# EAGLE design ACS758CurrentSensor (EAGLE 7.4.0)
CNAME: Current Sensor; CREVISION: 1.0; DESIGNER: Ye Wang
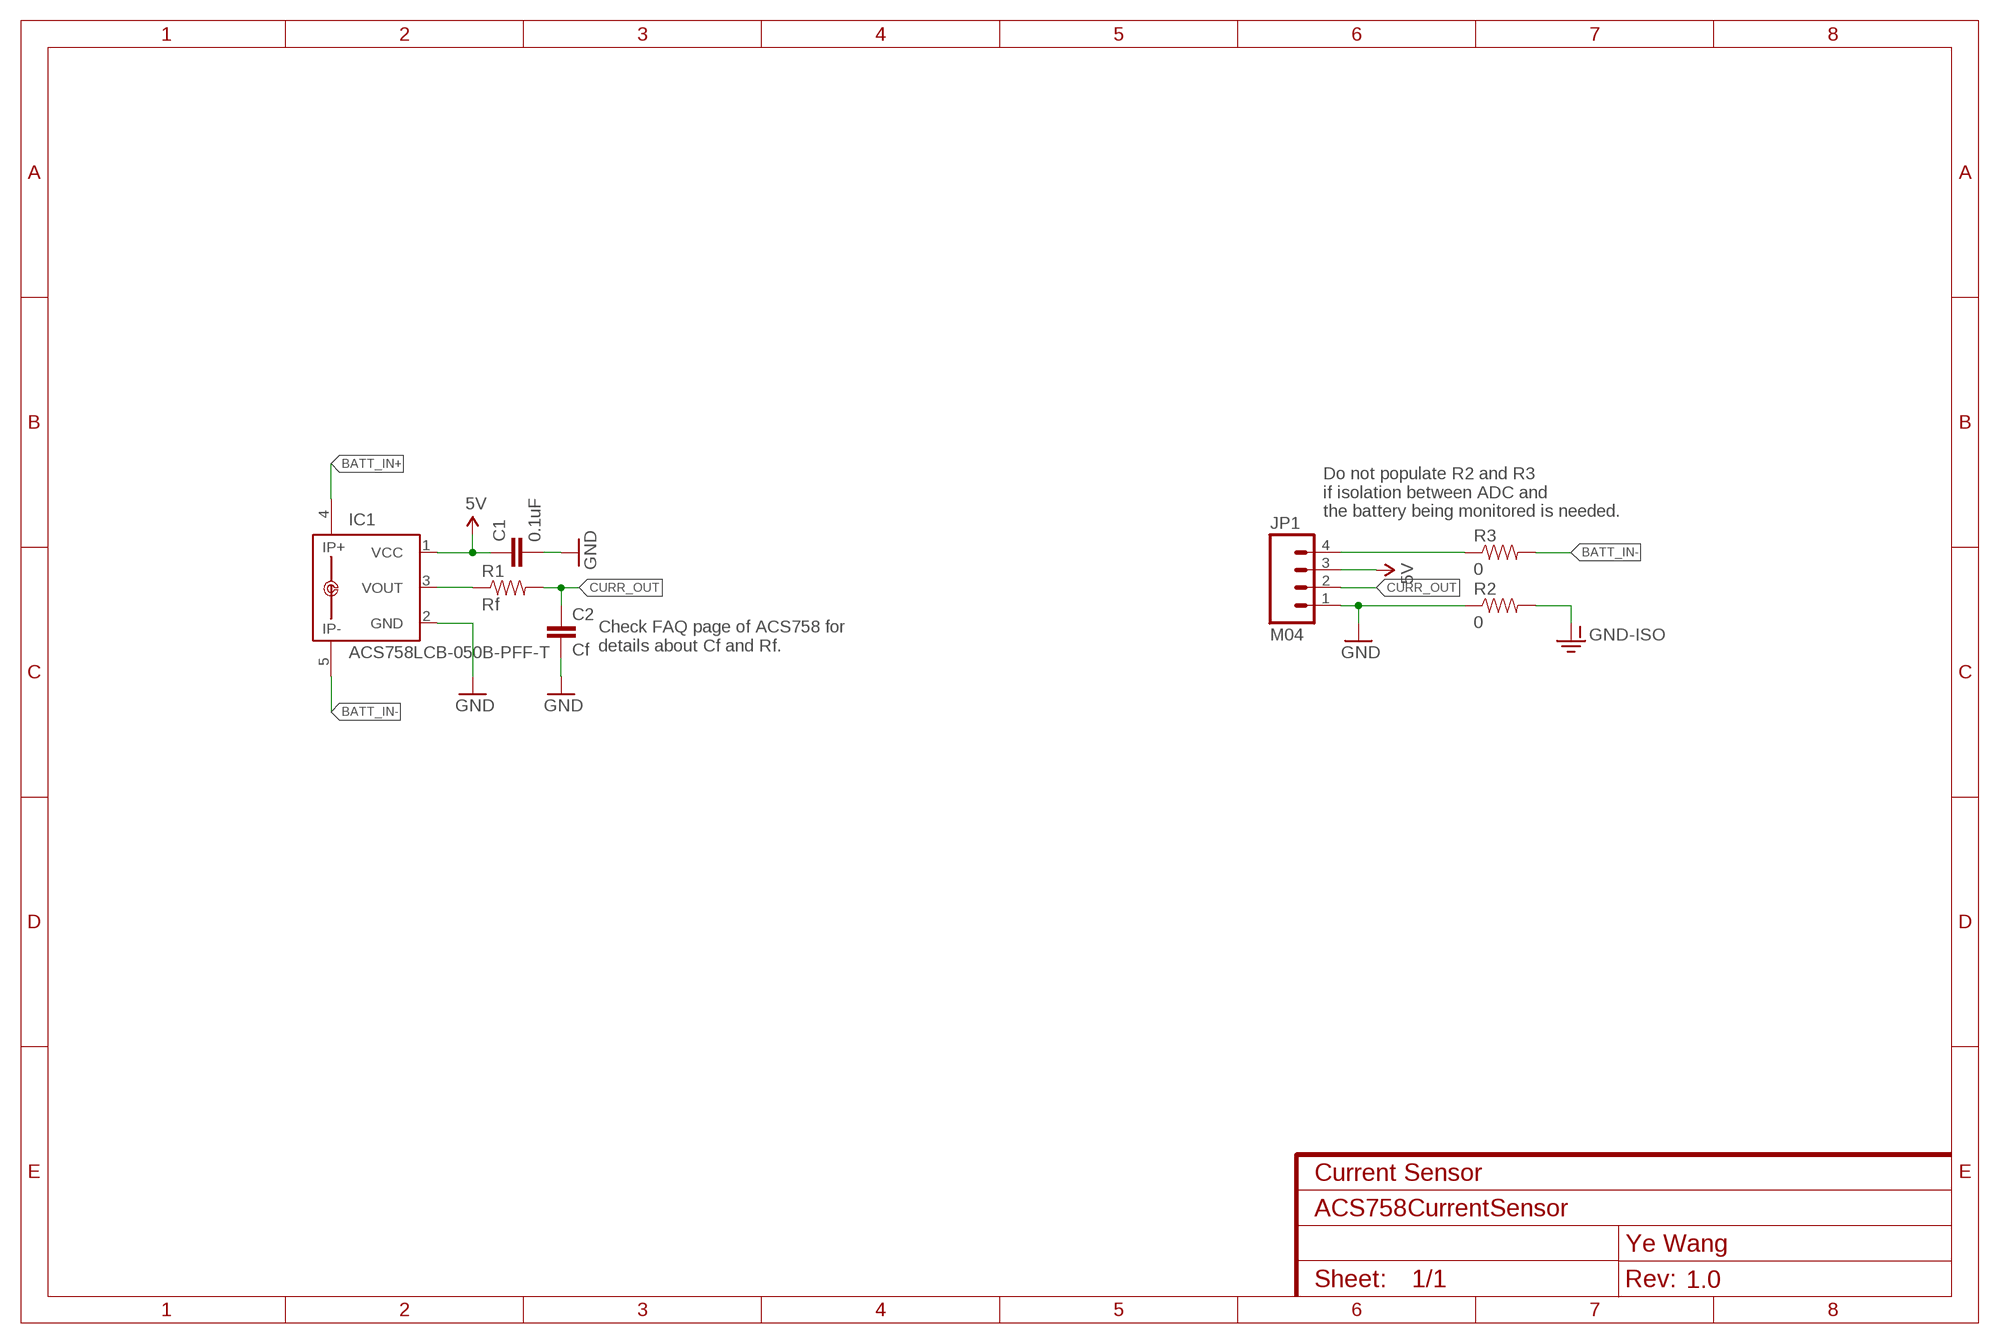
[diagram p0: schematic, sheet 1]

## Parts
C1  0.1uF  CAP0603-CAP  [0603-CAP]
C2  Cf  CAP0603-CAP  [0603-CAP]
IC1  ACS758LCB-050B-PFF-T  [CB-PFF]
JP1  M04  M04PTH  [1X04]
R1  Rf  0OHM-1/10W-5%(0603)  [0603]
R2  0  0OHM-1/10W-5%(0603)  [0603]
R3  0  0OHM-1/10W-5%(0603)  [0603]

## Nets
5V: C1.1 IC1.1(VCC) JP1.3
BATT_IN+: IC1.4(IP+)
BATT_IN-: IC1.5(IP-) R3.2
CURR_OUT: C2.1 JP1.2 R1.2
GND: C1.2 C2.2 IC1.2(GND) JP1.1 R2.1
GND-ISO: R2.2
N$1: IC1.3(VOUT) R1.1
N$2: JP1.4 R3.1
Unconnected: IC1.IP+1 IC1.IP-1

## Notes on the sheet
- Do not populate R2 and R3
  if isolation between ADC and
  the battery being monitored is needed.
- Check FAQ page of ACS758 for
  details about Cf and Rf.

## Library data of the parts
C1 C2 = SparkFun-Capacitors:CAP: Capacitor Standard 0603 ceramic capacitor, and 0.1" leaded capacitor.
IC1 = allegro:ACS758*: Thermally Enhanced, Fully Integrated, Hall Effect-Based Linear Current Sensor with 100 micro Ohm Current Conductor display layer 49 Reference in BRD and place VIAs on circles Datasheet: http://www.allegromicro.com/en/Products/Part_Numbers/0758/0758.pdf FAQ: http://www.allegromicro.com/en/Products/Current-Sensor-ICs/Fifty-To-Two-Hundred-Amp-Integrated-Conductor-Sensor-ICs/ACS758/ACS758-Frequently-Asked-Questions.aspx; MPN: ACS758LCB-050B-PFF-T; OC_FARNELL: 1718997; OC_NEWARK: 04R7131
JP1 = SparkFun-Connectors:M04: Header 4 Standard 4-pin 0.1" header. Use with straight break away headers (SKU : PRT-00116), right angle break away headers (PRT-00553), swiss pins (PRT-00743), machine pins (PRT-00117), and female headers (PRT-00115). Molex polarized connector foot print use with SKU : PRT-08231 with associated crimp pins and housings. 1MM SMD Version SKU: PRT-10208
R1 = SparkFun-Resistors:0OHM-1/10W-5%(0603): RES-08609; PROD_ID: RES-08609; VALUE: 0
R2 R3 = SparkFun-Resistors:0OHM-1/10W-5%(0603): RES-08609; PROD_ID: RES-08609

## Board
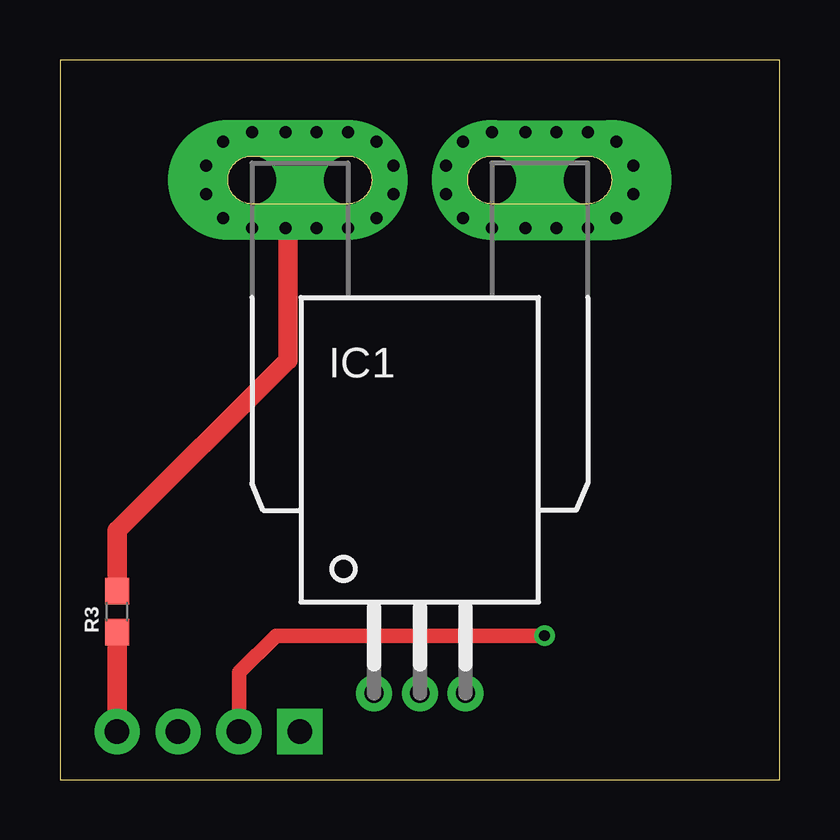
[diagram p1: board, top side]
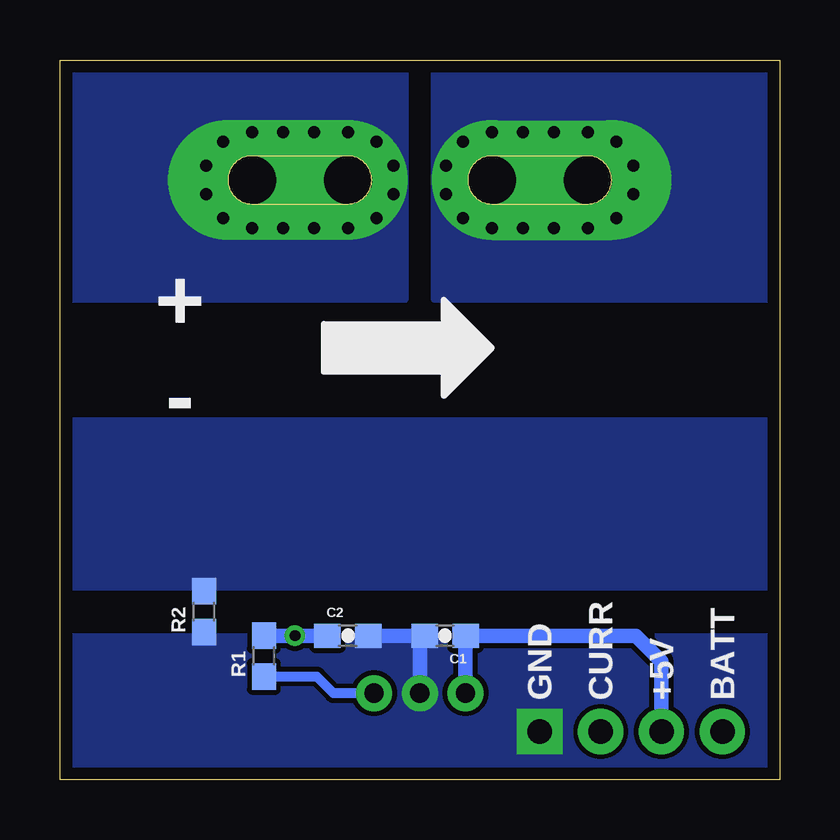
[diagram p2: board, bottom side, seen from below]

Size 30 x 30 mm. Coordinates in mm from the lower left corner, seen from the top.
Outline: 0,0 30,0 30,30 0,30 0,0
Copper layers (1*16): Top 0.035mm / dielectric 1.5mm / Bottom 0.035mm
Design rules "default *": minimum track width 10mil, minimum drill 0.3mm, track to track 8mil, track to pad 8mil, pad to pad 8mil, via to via 8mil, smd to smd 8mil, copper to edge 20mil, drill to drill 8mil, minimum pad ring 10mil, minimum via ring 8mil, stop-mask expansion 4mil, vias tented up to drill 0mil, thermal gap 10mil

### Footprints (pad centres in the part's own frame; a part is rotated, then mirrored left to right if it is on the bottom)
0603-CAP = smd 1.1 x 1: 1 -0.85,0; 2 0.85,0
CB-PFF = drill 0.8 pad 1.5: 1 -1.91,-21.4; 2 0,-21.4; 3 1.91,-21.4 | drill 2 pad 5 offset: 4 3,0; 5 -3,0 | drill 2 pad 4 offset: IP+1 7,0; IP-1 -7,0
1X04 = drill 1.016 pad 1.88 square: 1 0,0 | drill 1.016 pad 1.88: 2 2.54,0; 3 5.08,0; 4 7.62,0
0603 = smd 1.1 x 1: 1 -0.85,0; 2 0.85,0

### Placement (x,y rotation side)
C1  13.94,6 180 bottom
C2  18,6 0 bottom
IC1  15,25 0 top
JP1  10,2 180 top
R1  21.5,5.15 90 bottom
R2  24,7 90 bottom
R3  2.38,7 90 top

### Tracks (layer width: path | path; a pad name or v marks a point on that pad's centre or on a via)
5V
  Bottom 0.61: JP1.3 4.92,4.92 6,6 C1.1 IC1.1
BATT_IN+  (via drill 0.5)
  other vias: 18,27 19.4,27 20.7,27 22,27 23.2,26.6 23.9,25.6 23.9,24.4 23.2,23.4 22,23 20.7,23 19.4,23 18,23 16.8,23.4 16.1,24.4 16.1,25.6 16.8,26.6
  pour Bottom (no thermals): 15.6,20 30,20 30,30 15.6,30
BATT_IN-  (via drill 0.5)
  Top 0.813: R3.2 2.38,10.38 9.5,17.5 9.5,22.9 v9.4,23
  other vias: 8,27 12,27 9.4,27 10.7,27 13.2,26.6 13.9,25.6 13.9,24.4 13.2,23.4 12,23 10.7,23 8,23 6.8,23.4 6.1,24.4 6.1,25.6 6.8,26.6
  pour Bottom (no thermals): 0,20 14.4,20 14.4,30 0,30
CURR_OUT  (via drill 0.45)
  Top 0.61: JP1.2 7.46,4.46 9,6 v20.2,6
  Bottom 0.61: C2.1 v20.2,6 R1.2
GND
  Bottom 0.61: C2.2 C1.2 15,5.79 IC1.2
  pour Bottom (rank 2, no thermals): 0,0 30,0 30,6 0,6
GND-ISO
  pour Bottom (no thermals): 0,8 30,8 30,15 0,15
N$1
  Bottom 0.406: IC1.3 18.6,3.6 19.3,4.3 R1.1
N$2
  Top 0.813: JP1.4 R3.1

### Text on the board
bPlace: + | - | BATT | +5V | CURR | GND
tDocu: 4. Apply suffcient amount of solder to the termials. / Check the joints carefully to make sure there is no cold joint. | 5. Solder the power wires. | How to assemble this board / 1. Solder all SMD parts. | 6. [Optional] It's recommended to apply additional / <-layer of solder to increase current capacity. | 2. Solder 4-pin connector-> | 3. Put the sensor in the holes. / Solder the three signal pins first.